# Altium project MCORD_Hub_v1.1.PrjPcb (part 2 of 4)

## Sheet Boost_CNV.SchDoc: MCORD_HUB
size 420 x 297 mm; Author: G.Kasprowicz; CompanyName: WUT ISE; DrawnBy: G.Kasprowicz; Organization: WUT ISE; Address1: PW ISE; Address2: Nowowiejska 15/19 00-665 Warsaw; Address3: gkasprow@gmail.com; DocumentNumber: 5; Revision: 2; SheetNumber: 5; SheetTotal: 6; ModifiedBy: -; CheckedDate: -; Title2: 70V boost converter; DivGrp: WUT ISE; Designer: G.Kasprowicz; ModifiedDate: -; ProjectName: Sensor Box
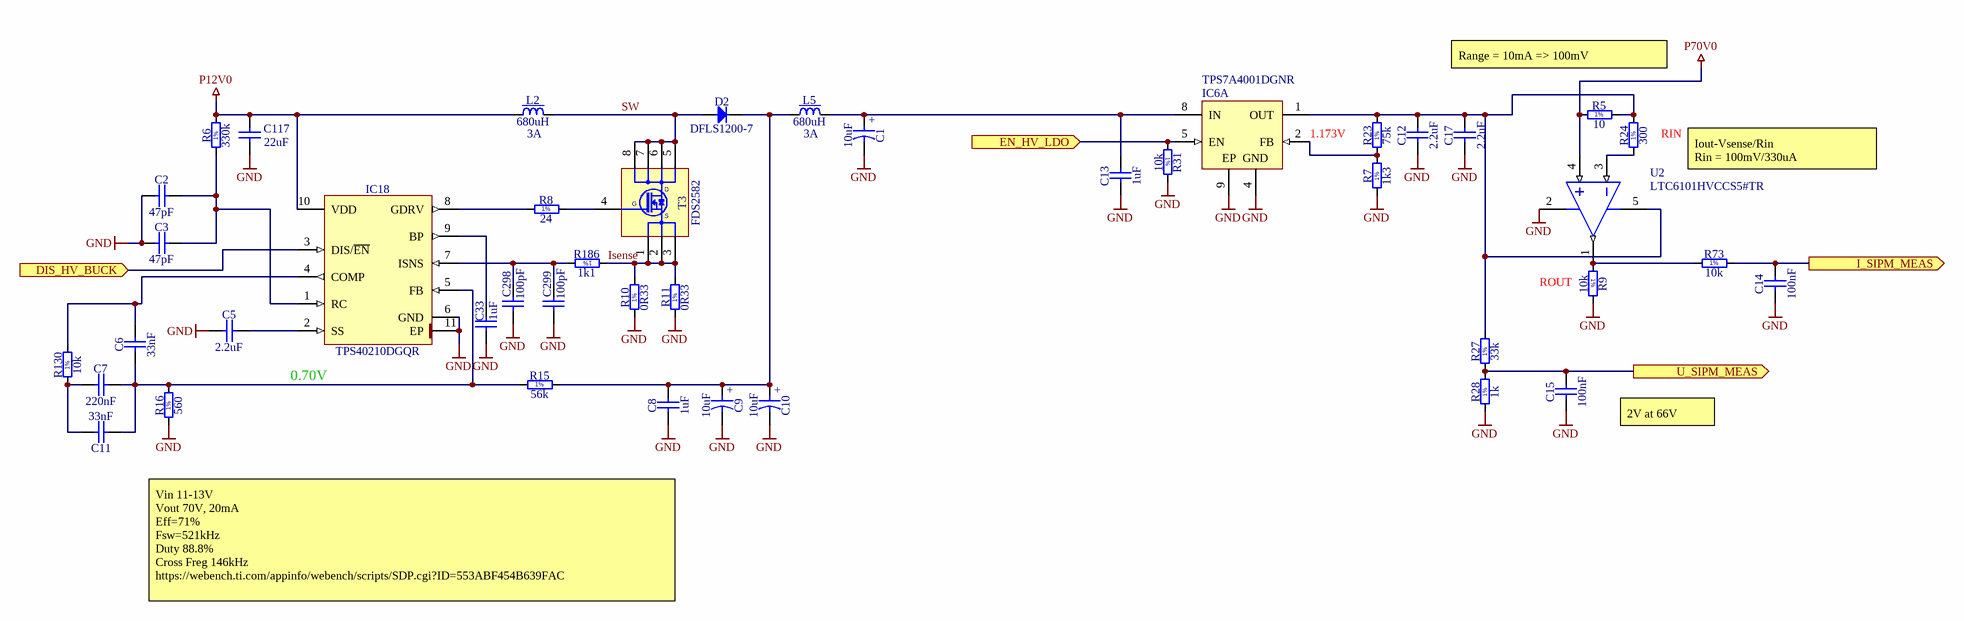
[diagram p2: Boost_CNV.SchDoc]

### Parts
C1  10uF  [CAPAE830X1020N]
C2  47pF  [CAPC1005X55N]
C3  47pF  [CAPC1005X55N]
C5  2.2uF  [CAPC2012X135N]
C6  33nF  [CAPC2012X135N]
C7  220nF  [CAPC2012X135N]
C8  1uF  [CAPC2013X145N]
C9  10uF  [CAPAE830X1020N]
C10  10uF  [CAPAE830X1020N]
C11  33nF  [CAPC2012X135N]
C12  2.2uF  [CAPC3225X230N]
C13  1uF  [CAPC2013X145N]
C14  100nF  [CAPC1005X55N]
C15  100nF  [CAPC1005X55N]
C17  2.2uF  [CAPC3225X230N]
C33  1uF  [CAPC1608X87N]
C117  22uF  [CAPC3216X180N]
C298  100pF  [CAPC1608X87N]
C299  100pF  [CAPC1608X87N]
D2  DFLS1200-7  [DIODES-INC_POWERDI123]
IC6  TPS7A4001DGNR  [DGN0008B_M]  (part A of 2)
IC18  TPS40210DGQR  [SOP50P490X110-11N-R157X188]
L2  680uH  Power: 3A  [IND_EPCOS_B82476A1]
L5  680uH  Power: 3A  [IND_EPCOS_B82476A1]
R5  10  [RESC3216X65N]
R6  330k  [RESC1608X55N]
R7  1k3  [RESC1608X55N]
R8  24  [RESC1608X55N]
R9  10k  [RESC1005X40N]
R10  0R33  [RESC3216X65N]
R11  0R33  [RESC3216X65N]
R15  56k  [RESC1608X55N]
R16  560  [RESC1608X55N]
R23  75k  [RESC1608X55N]
R24  300  [RESC1005X40N]
R27  33k  [RESC2012X60N]
R28  1k  [RESC1005X40N]
R31  10k  [RESC1005X40N]
R73  10k  [RESC1005X40N]
R130  10k  [RESC1005X40N]
R186  1k1  [RESC1608X55N]
T3  FDS2582  [SOIC127P600X175-8N]
U2  LTC6101HVCCS5#TR  [LT-S5-5-TSOT-23_M]

### Ports
DIS_HV_BUCK (in), EN_HV_LDO (in), I_SIPM_MEAS (out), U_SIPM_MEAS (out)

### Nets
GND: C1.2 C2.1 C3.1 C5.1 C8.1 C9.2 C10.2 C12.1 C13.1 C14.1 C15.1 C17.1 C33.1 C117.1 C298.1 C299.1 IC6.4(GND) IC6.9(EP) IC18.6(GND) IC18.11(EP) R7.1 R9.2 R10.1 R11.1 R16.1 R28.1 R31.2 U2.2(V-)
P12V0: C117.2 IC18.10(VDD) L2.1 R6.2
P70V0: R5.1 U2.4(+IN)
DIS_HV_BUCK: IC18.3(DIS/~{EN}) ; port DIS_HV_BUCK
EN_HV_LDO: IC6.5(EN) R31.1 ; port EN_HV_LDO
I_SIPM_MEAS: C14.2 R73.2 ; port I_SIPM_MEAS
Isense: R10.2 R11.2 R186.1 T3.1(S) T3.2(S) T3.3(S)
SW: D2.2(A) L2.2 T3.5(D) T3.6(D) T3.7(D) T3.8(D)
U_SIPM_MEAS: C15.2 R27.1 R28.2 ; port U_SIPM_MEAS
NetC1_1: C1.1 C13.2 IC6.8(IN) L5.2
NetC2_2: C2.2 C3.2 IC18.1(RC) R6.1
NetC5_2: C5.2 IC18.2(SS)
NetC6_1: C6.1 C7.2 C11.1 IC18.5(FB) R15.1 R16.2
NetC6_2: C6.2 IC18.4(COMP) R130.2
NetC7_1: C7.1 C11.2 R130.1
NetC8_2: C8.2 C9.1 C10.1 D2.1(C) L5.1 R15.2
NetC12_2: C12.2 C17.2 IC6.1(OUT) R5.2 R23.2 R24.2 R27.2 U2.5(V+)
NetC33_2: C33.2 IC18.9(BP)
NetC298_2: C298.2 C299.2 IC18.7(ISNS) R186.2
NetIC6_2: IC6.2(FB) R7.2 R23.1
NetIC18_8: IC18.8(GDRV) R8.1
NetR8_2: R8.2 T3.4(G)
NetR9_1: R9.1 R73.1 U2.1(OUT)
NetR24_1: R24.1 U2.3(-IN)

### Notes on the sheet
- Range = 10mA => 100mV
- 1.173V
- (near R24) RIN
- Iout-Vsense/Rin
  Rin = 100mV/330uA
- ROUT
- (near IC18) 0.70V
- 2V at 66V
- Vin 11-13V
  Vout 70V, 20mA
  Eff=71%
  Fsw=521kHz
  Duty 88.8%
  Cross Freg 146kHz
  https://webench.ti.com/appinfo/webench/scripts/SDP.cgi?ID=553ABF454B639FAC
- Project/Equipment
- Document
- Designer
- Drawn by
- Check.by
- Copyright WUT ISE 2018.
  This documentation describes Open Hardware and is licensed under the CERN OHL v.1.1. You may redistribute and modify this documentation under the terms of the CERN OHL v.1.1. (http://ohwr.org/CERNOHL). This documentation is distributed WITHOUT ANY EXPRESS OR IMPLIED WARRANTY, INCLUDING OF MERCHANTABILITY, SATISFACTORY QUALITY AND FITNESS FOR A PARTICULAR PURPOSE. Please see the CERN OHL v.1.1 for applicable conditions.
- Contact
- File
- Last Mod.
- Print Date
- Sheet
- Size
- A3
- of
- Rev
- (in symbol CAP_ELECTRO_SMD_F_10u_100V) +
- (in symbol R0402_1K_1%_0.0625W_100PPM) 1%
- (in symbol R0402_10K_1%_0.0625W_100PPM) 1%
- (in symbol R0402_300R_1%_0.0625W_100PPM) 1%
- (in symbol R0603_1K1_1%_0.1W_100PPM) 1%
- (in symbol R0603_1K3_1%_0.1W_100PPM) 1%
- (in symbol R0603_24R_1%_0.1W_100PPM) 1%
- (in symbol R0603_56K_1%_0.1W_100PPM) 1%
- (in symbol R0603_75K_1%_0.1W_100PPM) 1%
- (in symbol R0603_330K_1%_0.1W_100PPM) 1%
- (in symbol R0603_560R_1%_0.1W_100PPM) 1%
- (in symbol R0805_33K_1%_0.125W_100PPM) 1%
- (in symbol R1206_0R33_1%_0.5W_600PPM) 1%
- (in symbol R1206_10R_1%_0.25W_200PPM) 1%

### Library data of the parts
C1 C9 C10 = CAP_ELECTRO_SMD_F_10u_100V: 10uF, 100V, 1.5R; Part Number: CAE830-1020_10UF_100V_20%; Part Description: Aluminum Electrolytic SMT Capacitor; Manufacturer: PANASONIC; Manufacturer Part Number: EEEHD2A100P; Tolerance: ±20%; Table: Capacitors SMD; Component Kind: Standard; Component Type: Standard; Pin Count: 2; Value: 10uF; Status: Recommended; Voltage: 100V; Case: F; Mounted: Yes; Socket: No; SMD: Yes; ComponentHeight: 10.2mm; HelpURL: \\cern.ch\dfs\Applications\Altium\Datasheets\CAE_PANASONIC_FK.pdf; Author: CERN DEM JLC; CreateDate: 2007-12-03; LatestRevisionDate: 2014-11-05
C2 C3 = CC0402_47PF_50V_5%_C0G: Non-polarised capacitor; Part Description: SMD Multilayer Chip Ceramic Capacitor; Manufacturer: GENERIC; Manufacturer1 Part Number: C0402C470J5GACTU; Voltage: 50V; TC: C0G/NP0; Tolerance: ±5%; Part Number: CC0402_47PF_50V_5%_C0G; Component Kind: Standard; Component Type: Standard; Pin Count: 2; Value: 47pF; Status: Preferred; Manufacturer Part Number: CC0402_47PF_50V_5%_C0G; Case: 0402; Mounted: Yes; Socket: No; SMD: Yes; Sense: No; Manufacturer1 Example: KEMET; Manufacturer1 ComponentHeight: 0.55mm; HelpURL: \\cern.ch\dfs\Applications\Altium\Datasheets\CC0805_C0G_KEMET_(Commercial Grade).pdf; Author: CERN DEM JLC; CreateDate: 03.12.2007; LatestRevisionDate: 22.04.2015
C5 = CC0805_2.2UF_16V_10%_X7R: Non-polarised capacitor; Part Description: SMD Multilayer Chip Ceramic Capacitor; Manufacturer: GENERIC; Manufacturer1 Part Number: GRM21BF51C225ZA01L; Voltage: 16V; TC: X7R; Tolerance: ±10%; Part Number: CC0805_2.2UF_16V_10%_X7R; Component Kind: Standard; Component Type: Standard; Pin Count: 2; Value: 2.2uF; Status: Preferred; Manufacturer Part Number: CC0805_2.2UF_16V_10%_X7R; Case: 0805; Mounted: Yes; Socket: No; SMD: Yes; Sense: No; Manufacturer1 Example: MURATA; Manufacturer1 ComponentHeight: 1.5mm; HelpURL: \\cern.ch\dfs\Applications\Altium\Datasheets\CC0805_X7R_MURATA_GRM.pdf; Author: CERN DEM JLC; CreateDate: 03.12.2007; LatestRevisionDate: 18.09.2014
C6 C11 = CC0805_33NF_25V_10%_X7R: Non-polarised capacitor; Part Description: SMD Multilayer Chip Ceramic Capacitor; Manufacturer: GENERIC; Manufacturer1 Part Number: 223891015643; Voltage: 25V; TC: X7R; Tolerance: ±10%; Part Number: CC0805_33NF_25V_10%_X7R; Component Kind: Standard; Component Type: Standard; Pin Count: 2; Value: 33nF; Status: Preferred; Manufacturer Part Number: CC0805_33NF_25V_10%_X7R; Case: 0805; Mounted: Yes; Socket: No; SMD: Yes; Sense: No; Manufacturer1 Example: PHYCOMP; Manufacturer1 ComponentHeight: 1.35mm; HelpURL: \\cern.ch\dfs\Applications\Altium\Datasheets\CC0805_X7R_PHYCOMP.pdf; Author: CERN DEM JLC; CreateDate: 03.12.2007; LatestRevisionDate: 03.12.2007
C7 = CC0805_220NF_50V_10%_X7R: Non-polarised capacitor; Part Description: SMD Multilayer Chip Ceramic Capacitor; Manufacturer: GENERIC; Manufacturer1 Part Number: GRM21BR71H224KA01L; Voltage: 50V; TC: X7R; Tolerance: ±10%; Part Number: CC0805_220NF_50V_10%_X7R; Component Kind: Standard; Component Type: Standard; Pin Count: 2; Value: 220nF; Status: Preferred; Manufacturer Part Number: CC0805_220NF_50V_10%_X7R; Case: 0805; Mounted: Yes; Socket: No; SMD: Yes; Sense: No; Manufacturer1 Example: MURATA; Manufacturer1 ComponentHeight: 1.35mm; HelpURL: \\cern.ch\dfs\Applications\Altium\Datasheets\CC0805_X7R_MURATA.pdf; Author: CERN DEM JLC; CreateDate: 03.12.2007; LatestRevisionDate: 03.12.2007
C8 C13 = CC0805_1UF_100V_10%_X7S: Non-polarised capacitor; Part Description: SMD Multilayer Chip Ceramic Capacitor; Manufacturer: TDK; Manufacturer Part Number: C2012X7S2A105K125AB; Voltage: 100V; TC: X7S; Tolerance: ±10%; Part Number: CC0805_1UF_100V_10%_X7S; Component Kind: Standard; Component Type: Standard; Pin Count: 2; Value: 1uF; Status: None; Case: 0805; Mounted: Yes; Socket: No; SMD: Yes; Sense: No; ComponentHeight: 1.45mm; HelpURL: \\cern.ch\dfs\Applications\Altium\Datasheets\CC0805_X7S_TDK_C.pdf; Author: CERN DEM JLC; CreateDate: 12.12.2013; LatestRevisionDate: 20.01.2015
C12 C17 = CC1210_2.2UF_100V_10%_X7R_MURATA_GCJ32DR72A225KA01L: Non-polarised capacitor; Part Description: Soft Termination SMD Chip Monolithic Ceramic Capacitor for Automotive; Manufacturer: MURATA; Voltage: 100V; TC: X7R; Tolerance: ±10%; Part Number: CC1210_2.2UF_100V_10%_X7R_MURATA_GCJ32DR72A225KA01L; Component Kind: Standard; Component Type: Standard; Pin Count: 2; Value: 2.2uF; Status: Not Recommended; Manufacturer Part Number: GCJ32DR72A225KA01L; Case: 1210; Mounted: Yes; Socket: No; SMD: Yes; Sense: No; HelpURL: \\cern.ch\dfs\Applications\Altium\Datasheets\CC1210_MURATA_GCJ32DR72A225KA01L.pdf; Author: CERN DEM JLC; CreateDate: 10.05.2017; LatestRevisionDate: 10.05.2017; ComponentHeight: 2.3mm
C14 C15 = CC0402_100NF_16V_10%_X7R: Non-polarised capacitor; Part Description: SMD Multilayer Chip Ceramic Capacitor; Manufacturer: GENERIC; Manufacturer1 Part Number: GRM155R71C104KA88D; Voltage: 16V; TC: X7R; Tolerance: ±10%; Part Number: CC0402_100NF_16V_10%_X7R; Component Kind: Standard; Component Type: Standard; Pin Count: 2; Value: 100nF; Status: Not Recommended; Manufacturer Part Number: CC0402_100NF_16V_10%_X7R; Case: 0402; Mounted: Yes; Socket: No; SMD: Yes; Sense: No; HelpURL: \\cern.ch\dfs\Applications\Altium\Datasheets\CC0402_X7R_MURATA_GRM.pdf; Author: CERN DEM JLC; CreateDate: 05.12.2013; LatestRevisionDate: 03.12.2007; Manufacturer1 Example: MURATA; Manufacturer1 ComponentHeight: 0.55mm
C33 = CC0603_1UF_16V_10%_X7R: Non-polarised capacitor; Part Description: SMD Multilayer Chip Ceramic Capacitor; Manufacturer: GENERIC; Manufacturer1 Part Number: 223824613663; Voltage: 16V; TC: X7R; Tolerance: ±10%; Table: Capacitors SMD; Part Number: CC0603_1UF_16V_10%_X7R; Component Kind: Standard; Component Type: Standard; Pin Count: 2; Value: 1uF; Status: Preferred; Manufacturer Part Number: CC0603_1uF_16V_10%_X7R; Case: 0603; Mounted: Yes; Socket: No; SMD: Yes; Manufacturer1 Example: PHYCOMP; Manufacturer1 ComponentHeight: 0.87mm; HelpURL: \\cern.ch\dfs\Applications\Altium\Datasheets\CC0805_X5R_PHYCOMP_HC.pdf; Author: CERN DEM JLC; CreateDate: 03/12/2007; LatestRevisionDate: 03/12/2007
C117 = CC1206_22UF_10V_10%_X7R: Non-polarised capacitor; Part Description: SMD Multilayer Chip Ceramic Capacitor; Manufacturer: GENERIC; Manufacturer1 Part Number: GRM31CR71A226KE15L; Voltage: 10V; TC: X7R; Tolerance: ±10%; Table: Capacitors SMD; Part Number: CC1206_22UF_10V_10%_X7R; Component Kind: Standard; Component Type: Standard; Pin Count: 2; Value: 22uF; Status: Preferred; Manufacturer Part Number: CC1206_22UF_10V_10%_X7R; Case: 1206; Mounted: Yes; Socket: No; SMD: Yes; Manufacturer1 Example: MURATA; Manufacturer1 ComponentHeight: 1.8mm; HelpURL: \\cern.ch\dfs\Applications\Altium\Datasheets\CC1206_X7R_MURATA_GRM-HI-CAP.pdf; Author: CERN DEM JLC; CreateDate: 2010-06-08; LatestRevisionDate: 2010-06-08
C298 C299 = CC0603_100PF_50V_5%_NP0: Non-polarised capacitor; Part Description: SMD Multilayer Chip Ceramic Capacitor; Manufacturer: GENERIC; Manufacturer1 Part Number: 223886715101; Voltage: 50V; TC: NP0; Tolerance: ±5%; Table: Capacitors SMD; Part Number: CC0603_100PF_50V_5%_NP0; Component Kind: Standard; Component Type: Standard; Pin Count: 2; Value: 100pF; Status: Preferred; Manufacturer Part Number: CC0603_100PF_50V_5%_NP0; Case: 0603; Mounted: Yes; Socket: No; SMD: Yes; Manufacturer1 Example: PHYCOMP; Manufacturer1 ComponentHeight: 0.87mm; HelpURL: \\cern.ch\dfs\Applications\Altium\Datasheets\CC0603_NP0_PHYCOMP.pdf; Author: CERN DEM JLC; CreateDate: 2007-12-03; LatestRevisionDate: 2007-12-03
D2 = DFLS1200-7: Diode; Part Description: High Voltage Schttky Barrier Rectifier; Manufacturer: DIODES INCORPORATED; Voltage: 200V; Power: 1A; PressFit: No; Bonding: No; Part Number: DFLS1200-7; Component Kind: Standard; Component Type: Standard; Device: DFLS1200-7; PackageDescription: SODFL Diode; 2.8mm W X 1.78mm L X mm H Body, POWERDI®123 Case; Manufacturer Part Number: DFLS1200-7; Pin Count: 2; Mounted: Yes; Socket: No; SMD: Yes; Sense: No; ComponentHeight: 1mm; HelpURL: \\cern.ch\dfs\Applications\Altium\Datasheets\DFLS1200-7.pdf; Author: CERN DEM JLC; CreateDate: 15.09.2014; LatestRevisionDate: 15.09.2014
IC6 = CMP-0394-01258-2: Single Output LDO, 50 mA, Adjustable 1.175 to 90 V Output, 7 to 100 V Input, 8-pin MSOP (DGN), -40 to 125 degC, Green (RoHS & no Sb/Br); Manufacturer: Texas Instruments; Iout(Max)(A): 0.05; Vin(Max)(V): 100; Vout Adj(Min)(V): 1.2; Accuracy(%): 2.5; SubFamily: Single Channel LDO; Vin(Min)(V): 7; Iq(Typ)(mA): 0.02; Vdo(Typ)(mV): 290; Vout Adj(Max)(V): 90; ComponentLink1URL: http://www.ti.com/; PackageDescription: 8-Pin Plastic Small Outline, Body 3 x 3 mm, Pitch 0.65 mm; PartNumber: TPS7A4001DGNR; Mounting Technology: Surface Mount; PackageReference: DGN0008B; ComponentLink1Description: Manufacturer URL; Code_JEDEC: MO-187; DatasheetVersion: SBVS162A; ComponentLink2URL: http://www.ti.com/general/docs/lit/getliterature.tsp?genericPartNumber=TPS7A4001&fileType=pdf; ComponentLink2Description: Datasheet; Eco-Plan: Green (RoHS & no Sb/Br); PackageVersion: 4073271/F; ComponentLink3URL: http://www.ti.com/litv/pdf/mpds046e; ComponentLink3Description: Package Specification
IC18 = TPS40210DGQR: Wide-Input Voltage (4.5V to 52V) Input Current Mode Boost Controller; Manufacturer: TEXAS INSTRUMENTS; Table: Regulators; Part Number: TPS40210DGQR; Component Kind: Standard; Component Type: Standard; Device: TPS40210DGQR; PackageDescription: SOP, 0.50mm, pitch; 10 pin, 3.00mm W X 3.00mm L X 1.10mm H body (w/thermal tab  1.57 X 1.88 mm), IPC Medium Density; Part Description: Wide-Input Voltage (4.5V to 52V) Input Current Mode Boost Controller; Manufacturer Part Number: TPS40210DGQR; Pin Count: 11; Case: TSSOP10; Mounted: Yes; Socket: No; SMD: Yes; ComponentHeight: 1.1mm; HelpURL: \\cern.ch\dfs\Applications\Altium\Datasheets\TPS40210DGQR.pdf; Author: CERN DEM JLC; CreateDate: 16/04/2012; LatestRevisionDate: 16/04/2012
L2 L5 = IND_680UH_20%_EPCOS_B82476A1: 680uH, 3A, 0.17R; Part Number: IND_680UH_20%_COILCRAFT_DO3340P-684MLB; Part Description: SMT Power Inductor (12.95x9.4x5.08mm); Manufacturer: Coilcraft; Manufacturer Part Number: DO3340P-684MLB; Tolerance: ±20%; Component Kind: Standard; Component Type: Standard; Pin Count: 2; Value: 680uH; Status: None; Resistance: 0.17R; Mounted: Yes; Socket: No; SMD: Yes; Sense: No; ComponentHeight: 3mm; HelpURL: \\cern.ch\dfs\Applications\Altium\Datasheets\IND_EPCOS_B82476A1.pdf; Author: GK; CreateDate: 07.01.2014; LatestRevisionDate: 07.01.2014
R5 = R1206_10R_1%_0.25W_200PPM: Resistor - 1%; Part Description: General Purpose Thick Film Chip Resistor; Manufacturer: GENERIC; Manufacturer1 Part Number: NRC12F10R0TRF; Power: 0.25W; TC: ±200ppm/°C; PressFit: No; Part Number: R1206_10R_1%_0.25W_200PPM; Component Kind: Standard; Component Type: Standard; Pin Count: 2; Value: 10; Status: Preferred; Tolerance: ±1%; Manufacturer Part Number: R1206_10R_1%_0.25W_200PPM; Case: 1206; Mounted: Yes; Sense: No; Socket: No; SMD: Yes; Manufacturer1 Example: NIC COMPONENT; Manufacturer1 ComponentHeight: 0.65mm; HelpURL: \\cern.ch\dfs\Applications\Altium\Datasheets\R1206_NIC_NRC.pdf; Author: CERN DEM JLC; CreateDate: 24.06.2009; LatestRevisionDate: 24.06.2009
R6 = R0603_330K_1%_0.1W_100PPM: Resistor - 1%; Part Description: General Purpose Thick Film Chip Resistor; Manufacturer: GENERIC; Manufacturer1 Part Number: NRC06F3303TRF; Power: 0.1W; TC: ±100ppm/°C; PressFit: No; Part Number: R0603_330K_1%_0.1W_100PPM; Component Kind: Standard; Component Type: Standard; Pin Count: 2; Value: 330k; Status: Preferred; Tolerance: ±1%; Manufacturer Part Number: R0603_330K_1%_0.1W_100PPM; Case: 0603; Mounted: Yes; Sense: No; Socket: No; SMD: Yes; Manufacturer1 Example: NIC COMPONENT; Manufacturer1 ComponentHeight: 0.55mm; HelpURL: \\cern.ch\dfs\Applications\Altium\Datasheets\R0603_NIC_NRC.pdf; Author: CERN DEM JLC; CreateDate: 03.12.2007; LatestRevisionDate: 13.03.2008
R7 = R0603_1K3_1%_0.1W_100PPM: Resistor - 1%; Part Description: General Purpose Thick Film Chip Resistor; Manufacturer: GENERIC; Manufacturer1 Part Number: NRC06F1301TRF; Power: 0.1W; TC: ±100ppm/°C; PressFit: No; Part Number: R0603_1K3_1%_0.1W_100PPM; Component Kind: Standard; Component Type: Standard; Pin Count: 2; Value: 1k3; Status: Preferred; Tolerance: ±1%; Manufacturer Part Number: R0603_1K3_1%_0.1W_100PPM; Case: 0603; Mounted: Yes; Sense: No; Socket: No; SMD: Yes; Manufacturer1 Example: NIC COMPONENT; Manufacturer1 ComponentHeight: 0.55mm; HelpURL: \\cern.ch\dfs\Applications\Altium\Datasheets\R0603_NIC_NRC.pdf; Author: CERN DEM JLC; CreateDate: 03.12.2007; LatestRevisionDate: 13.03.2008
R8 = R0603_24R_1%_0.1W_100PPM: Resistor - 1%; Part Description: General Purpose Thick Film Chip Resistor; Manufacturer: GENERIC; Manufacturer1 Part Number: NRC06F24R0TRF; Power: 0.1W; TC: ±100ppm/°C; PressFit: No; Part Number: R0603_24R_1%_0.1W_100PPM; Component Kind: Standard; Component Type: Standard; Pin Count: 2; Value: 24; Status: Preferred; Tolerance: ±1%; Manufacturer Part Number: R0603_24R_1%_0.1W_100PPM; Case: 0603; Mounted: Yes; Sense: No; Socket: No; SMD: Yes; Manufacturer1 Example: NIC COMPONENT; Manufacturer1 ComponentHeight: 0.55mm; HelpURL: \\cern.ch\dfs\Applications\Altium\Datasheets\R0603_NIC_NRC.pdf; Author: CERN DEM JLC; CreateDate: 03.12.2007; LatestRevisionDate: 13.03.2008
R9 R31 R73 R130 = R0402_10K_1%_0.0625W_100PPM: Resistor - 1%; Part Description: General Purpose Thick Film Chip Resistor; Manufacturer: GENERIC; Manufacturer1 Part Number: 232270671003L; TC: ±100ppm/°C; PressFit: No; Part Number: R0402_10K_1%_0.0625W_100PPM; Component Kind: Standard; Component Type: Standard; Pin Count: 2; Value: 10k; Status: Not Recommended; Power: 0.0625W; Tolerance: ±1%; Manufacturer Part Number: R0402_10K_1%_0.0625W_100PPM; Case: 0402; Mounted: Yes; Sense: No; Socket: No; SMD: Yes; Manufacturer1 Example: YAGEO PHYCOMP; Manufacturer1 ComponentHeight: 0.4mm; HelpURL: \\cern.ch\dfs\Applications\Altium\Datasheets\R0402_Phycomp_RC0402.pdf; Author: CERN DEM JLC; CreateDate: 03.12.2007; LatestRevisionDate: 17.10.2012
R10 R11 = R1206_0R33_1%_0.5W_600PPM: Resistor - 1%; Part Description: Low Ohmique High Power Chip Resistor; Manufacturer: YAGEO PHYCOMP; Manufacturer Part Number: RL1206FR-7W0R33 (235051913307); Power: 0.5W; TC: ±600ppm/°C; PressFit: No; Part Number: R1206_0R33_1%_0.5W_600PPM; Component Kind: Standard; Component Type: Standard; Pin Count: 2; Value: 0R33; Status: Not Recommended; Tolerance: ±1%; Case: 1206; Mounted: Yes; Sense: No; Socket: No; SMD: Yes; ComponentHeight: 0.65mm; HelpURL: \\cern.ch\dfs\Applications\Altium\Datasheets\R1206_PHYCOMP_LRC02P.pdf; Author: CERN DEM JMW; CreateDate: 06.01.2009; LatestRevisionDate: 06.01.2009
R15 = R0603_56K_1%_0.1W_100PPM: Resistor - 1%; Part Description: General Purpose Thick Film Chip Resistor; Manufacturer: GENERIC; Manufacturer1 Part Number: NRC06F5602TRF; Power: 0.1W; TC: ±100ppm/°C; PressFit: No; Part Number: R0603_56K_1%_0.1W_100PPM; Component Kind: Standard; Component Type: Standard; Pin Count: 2; Value: 56k; Status: Preferred; Tolerance: ±1%; Manufacturer Part Number: R0603_56K_1%_0.1W_100PPM; Case: 0603; Mounted: Yes; Sense: No; Socket: No; SMD: Yes; Manufacturer1 Example: NIC COMPONENT; Manufacturer1 ComponentHeight: 0.55mm; HelpURL: \\cern.ch\dfs\Applications\Altium\Datasheets\R0603_NIC_NRC.pdf; Author: CERN DEM JLC; CreateDate: 03.12.2007; LatestRevisionDate: 13.03.2008
R16 = R0603_560R_1%_0.1W_100PPM: Resistor - 1%; Part Description: General Purpose Thick Film Chip Resistor; Manufacturer: GENERIC; Manufacturer1 Part Number: NRC06F5600TRF; Power: 0.1W; TC: ±100ppm/°C; PressFit: No; Part Number: R0603_560R_1%_0.1W_100PPM; Component Kind: Standard; Component Type: Standard; Pin Count: 2; Value: 560; Status: Preferred; Tolerance: ±1%; Manufacturer Part Number: R0603_560R_1%_0.1W_100PPM; Case: 0603; Mounted: Yes; Sense: No; Socket: No; SMD: Yes; Manufacturer1 Example: NIC COMPONENT; Manufacturer1 ComponentHeight: 0.55mm; HelpURL: \\cern.ch\dfs\Applications\Altium\Datasheets\R0603_NIC_NRC.pdf; Author: CERN DEM JLC; CreateDate: 03.12.2007; LatestRevisionDate: 13.03.2008
R23 = R0603_75K_1%_0.1W_100PPM: Resistor - 1%; Part Description: General Purpose Thick Film Chip Resistor; Manufacturer: GENERIC; Manufacturer1 Part Number: NRC06F7502TRF; Power: 0.1W; TC: ±100ppm/°C; PressFit: No; Part Number: R0603_75K_1%_0.1W_100PPM; Component Kind: Standard; Component Type: Standard; Pin Count: 2; Value: 75k; Status: Preferred; Tolerance: ±1%; Manufacturer Part Number: R0603_75K_1%_0.1W_100PPM; Case: 0603; Mounted: Yes; Sense: No; Socket: No; SMD: Yes; Manufacturer1 Example: NIC COMPONENT; Manufacturer1 ComponentHeight: 0.55mm; HelpURL: \\cern.ch\dfs\Applications\Altium\Datasheets\R0603_NIC_NRC.pdf; Author: CERN DEM JLC; CreateDate: 03.12.2007; LatestRevisionDate: 13.03.2008
R24 = R0402_300R_1%_0.0625W_100PPM: Resistor - 1%; Part Description: General Purpose Thick Film Chip Resistor; Manufacturer: GENERIC; Manufacturer1 Part Number: 232270673001L; TC: ±100ppm/°C; PressFit: No; Part Number: R0402_300R_1%_0.0625W_100PPM; Component Kind: Standard; Component Type: Standard; Pin Count: 2; Value: 300; Status: Not Recommended; Power: 0.0625W; Tolerance: ±1%; Manufacturer Part Number: R0402_300R_1%_0.0625W_100PPM; Case: 0402; Mounted: Yes; Sense: No; Socket: No; SMD: Yes; Manufacturer1 Example: YAGEO PHYCOMP; Manufacturer1 ComponentHeight: 0.4mm; HelpURL: \\cern.ch\dfs\Applications\Altium\Datasheets\R0402_Phycomp_RC0402.pdf; Author: CERN DEM JLC; CreateDate: 03.12.2007; LatestRevisionDate: 17.10.2012
R27 = R0805_33K_1%_0.125W_100PPM: Resistor - 1%; Part Description: General Purpose Thick Film Chip Resistor; Manufacturer: GENERIC; Manufacturer1 Part Number: NRC10F3302TRF; Power: 0.125W; TC: ±100ppm/°C; PressFit: No; Part Number: R0805_33K_1%_0.125W_100PPM; Component Kind: Standard; Component Type: Standard; Pin Count: 2; Value: 33k; Status: Preferred; Tolerance: ±1%; Manufacturer Part Number: R0805_33K_1%_0.125W_100PPM; Case: 0805; Mounted: Yes; Sense: No; Socket: No; SMD: Yes; Manufacturer1 Example: NIC COMPONENT; Manufacturer1 ComponentHeight: 0.6mm; HelpURL: \\cern.ch\dfs\Applications\Altium\Datasheets\R0805_NIC_NRC.pdf; Author: CERN DEM JLC; CreateDate: 03.12.2007; LatestRevisionDate: 13.03.2008
R28 = R0402_1K_1%_0.0625W_100PPM: Resistor - 1%; Part Description: General Purpose Thick Film Chip Resistor; Manufacturer: GENERIC; Manufacturer1 Part Number: 232270671002L; TC: ±100ppm/°C; PressFit: No; Part Number: R0402_1K_1%_0.0625W_100PPM; Component Kind: Standard; Component Type: Standard; Pin Count: 2; Value: 1k; Status: Not Recommended; Power: 0.0625W; Tolerance: ±1%; Manufacturer Part Number: R0402_1K_1%_0.0625W_100PPM; Case: 0402; Mounted: Yes; Sense: No; Socket: No; SMD: Yes; Manufacturer1 Example: YAGEO PHYCOMP; Manufacturer1 ComponentHeight: 0.4mm; HelpURL: \\cern.ch\dfs\Applications\Altium\Datasheets\R0402_Phycomp_RC0402.pdf; Author: CERN DEM JLC; CreateDate: 03.12.2007; LatestRevisionDate: 17.10.2012
R186 = R0603_1K1_1%_0.1W_100PPM: Resistor - 1%; Part Description: General Purpose Thick Film Chip Resistor; Manufacturer: GENERIC; Manufacturer1 Part Number: NRC06F1101TRF; Power: 0.1W; TC: ±100ppm/°C; Table: Resistors SMD; Part Number: R0603_1K1_1%_0.1W_100PPM; Component Kind: Standard; Component Type: Standard; Pin Count: 2; Value: 1k1; Status: Preferred; Tolerance: ±1%; Manufacturer Part Number: R0603_1K1_1%_0.1W_100PPM; Case: 0603; Mounted: Yes; Socket: No; SMD: Yes; Manufacturer1 Example: NIC COMPONENT; Manufacturer1 ComponentHeight: 0.55mm; HelpURL: \\cern.ch\dfs\Applications\Altium\Datasheets\R0603_NIC_NRC.pdf; Author: CERN DEM JLC; CreateDate: 2007-12-03; LatestRevisionDate: 2008-03-13
T3 = FDS2582: 150V 4.1A N-Channel PowerTrench® MOSFET; Manufacturer: FAIRCHILD SEMICONDUCTOR; PressFit: No; Bonding: No; Part Number: FDS2582; Component Kind: Standard; Component Type: Standard; Device: FDS2582; PackageDescription: SOIC 8, Pitch 1.27mm - Body 4x5mm, IPC Medium Density; Part Description: 150V 4.1A N-Channel PowerTrench® MOSFET; Manufacturer Part Number: FDS2582; Pin Count: 8; Case: SOIC8; Mounted: Yes; Socket: No; SMD: Yes; Sense: No; ComponentHeight: 1.75mm; HelpURL: \\cern.ch\dfs\Applications\Altium\Datasheets\FDS2582.pdf; Author: CERN DEM JLC; CreateDate: 08.04.2009; LatestRevisionDate: 08.04.2009
U2 = CMP-0359-01901-2: Single Channel, High Voltage, High-Side Current Sense Operational Amplifier, 0.2 MHz Typical GBW, 4 to 60 V, 5-Pin SOT23 (S5-5), Commercial, Reel; Manufacturer: Linear Technology; Channels (#): 1; GBW (MHz) Typical: 0.2; Is (mA) Typical: 0.22; Vs Min (V): 4; Vs Max (V): 60; Vos (mV) Typical: 0.15; Code_JEDEC: MO-193; ComponentLink3URL: http://cds.linear.com/docs/en/packaging/SOT_5_05-08-1635.pdf; ComponentLink2URL: http://cds.linear.com/docs/en/datasheet/6101fh.pdf; PackageDescription: 5-Lead Plastic TSOT-23, Body 1.63 x 2.90 mm, Pitch 0.95 mm; ComponentLink3Description: Package Specification; PartNumber: LTC6101HVCCS5#TR; ComponentLink1Description: Manufacturer URL; Packing: Reel; Linear Technology Part Number: LTC6101HV; DatasheetVersion: Rev. H; ComponentLink1URL: http://www.linear.com/; ComponentLink2Description: Datasheet; Type: CSA; PackageReference: LT-S5-5-TSOT-23; Mounting Technology: Surface Mount; RevisionNote: URLs updated

## Sheet RMII_Ethernet.SchDoc
size A3
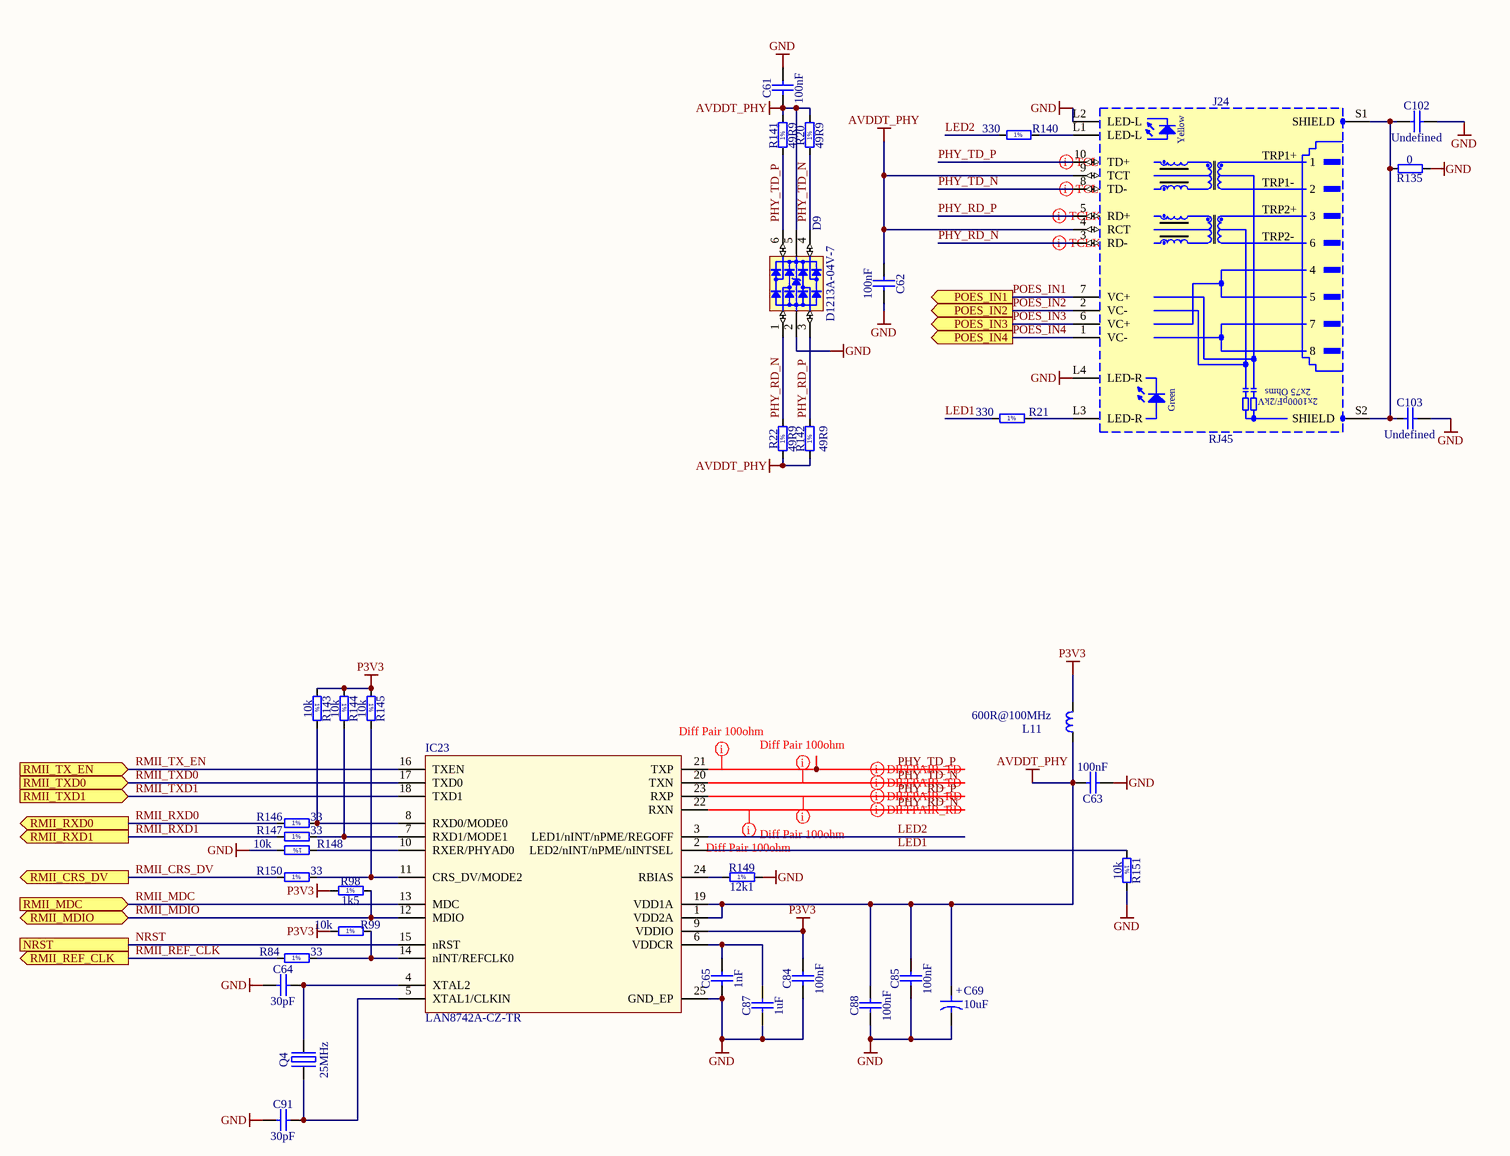
[diagram p3: RMII_Ethernet.SchDoc]

### Parts
C61  100nF  [CAPC1005X55N]
C62  100nF  [CAPC1005X55N]
C63  100nF  [CAPC1005X55N]
C64  30pF  [CAPC1005X55N]
C65  1nF  [CAPC1608X87N]
C69  10uF  [CAPMP3216X180N]
C84  100nF  [CAPC1005X55N]
C85  100nF  [CAPC1005X55N]
C87  1uF  [CAPC1608X87N]
C88  100nF  [CAPC1005X55N]
C91  30pF  [CAPC1005X55N]
C102  Undefined  [CAPC2012X135N]
C103  Undefined  [CAPC2012X135N]
D9  D1213A-04V-7  [SOTFL50P160X60-6N]
IC23  LAN8742A-CZ-TR  [QFN24_0R5_4X4]
J24  RJ45  [ABRACON_ARJM11C7-114-BA-EW2]
L11  600R@100MHz  [INDC1005X55N]
Q4  25MHz  [XTAL_ABRACON_ABLS]
R20  49R9  [RESC1005X40N]
R21  330  [RESC1005X40N]
R22  49R9  [RESC1005X40N]
R84  33  [RESC1005X40N]
R98  1k5  [RESC1005X40N]
R99  10k  [RESC1005X40N]
R135  0  [RESC1608X55N]
R140  330  [RESC1005X40N]
R141  49R9  [RESC1005X40N]
R142  49R9  [RESC1005X40N]
R143  10k  [RESC1005X40N]
R144  10k  [RESC1005X40N]
R145  10k  [RESC1005X40N]
R146  33  [RESC1005X40N]
R147  33  [RESC1005X40N]
R148  10k  [RESC1005X40N]
R149  12k1  [RESC1005X40N]
R150  33  [RESC1005X40N]
R151  10k  [RESC1005X40N]

### Ports
NRST, POES_IN1 (out), POES_IN2 (out), POES_IN3 (out), POES_IN4 (out), RMII_CRS_DV (out), RMII_MDC (in), RMII_MDIO (bidir), RMII_REF_CLK (out), RMII_RXD0 (out), RMII_RXD1 (out), RMII_TX_EN (in), RMII_TXD0 (in), RMII_TXD1 (in)

### Nets
AVDDT_PHY: C61.1 C62.2 C63.2 C69.1 C85.2 C88.2 D9.5(VBUS) IC23.1(VDD2A) IC23.19(VDD1A) J24.4(RCT) J24.9(TCT) L11.1 R20.2 R22.1 R141.2 R142.1
GND: C61.2 C62.1 C63.1 C64.1 C65.1 C69.2 C84.1 C85.1 C87.1 C88.1 C91.1 C102.2 C103.2 D9.2(GND) IC23.25(GND_EP) J24.L2(LED-L) J24.L4(LED-R) R135.1 R148.2 R149.2 R151.2
P3V3: C84.2 IC23.9(VDDIO) L11.2 R98.1 R99.1 R143.1 R144.1 R145.1
LED1: IC23.2(LED2/nINT/nPME/nINTSEL) R21.1 R151.1
LED2: IC23.3(LED1/nINT/nPME/REGOFF) R140.1
NRST: IC23.15(nRST) ; port NRST
PHY_RD_N: D9.1(I/O1) IC23.22(RXN) J24.3(RD-) R22.2
PHY_RD_P: D9.3(I/O2) IC23.23(RXP) J24.5(RD+) R142.2
PHY_TD_N: D9.4(I/O3) IC23.20(TXN) J24.8(TD-) R20.1
PHY_TD_P: D9.6(I/O4) IC23.21(TXP) J24.10(TD+) R141.1
POES_IN1: J24.7(VC+) ; port POES_IN1
POES_IN2: J24.2(VC-) ; port POES_IN2
POES_IN3: J24.6(VC+) ; port POES_IN3
POES_IN4: J24.1(VC-) ; port POES_IN4
RMII_CRS_DV: R150.1 ; port RMII_CRS_DV
RMII_MDC: IC23.13(MDC) ; port RMII_MDC
RMII_MDIO: IC23.12(MDIO) R98.2 ; port RMII_MDIO
RMII_REF_CLK: R84.1 ; port RMII_REF_CLK
RMII_RXD0: R146.1 ; port RMII_RXD0
RMII_RXD1: R147.1 ; port RMII_RXD1
RMII_TX_EN: IC23.16(TXEN) ; port RMII_TX_EN
RMII_TXD0: IC23.17(TXD0) ; port RMII_TXD0
RMII_TXD1: IC23.18(TXD1) ; port RMII_TXD1
NetC64_2: C64.2 IC23.4(XTAL2) Q4.2(OSC2)
NetC65_2: C65.2 C87.2 IC23.6(VDDCR)
NetC91_2: C91.2 IC23.5(XTAL1/CLKIN) Q4.1(OSC1)
NetC102_1: C102.1 C103.1 J24.S1(SHIELD) J24.S2(SHIELD) R135.2
NetIC23_7: IC23.7(RXD1/MODE1) R144.2 R147.2
NetIC23_8: IC23.8(RXD0/MODE0) R143.2 R146.2
NetIC23_10: IC23.10(RXER/PHYAD0) R148.1
NetIC23_11: IC23.11(CRS_DV/MODE2) R145.2 R150.2
NetIC23_14: IC23.14(nINT/REFCLK0) R84.2 R99.2
NetIC23_24: IC23.24(RBIAS) R149.1
NetJ24_L1: J24.L1(LED-L) R140.2
NetJ24_L3: J24.L3(LED-R) R21.2

### Layout directives
differential pair: PHY_RD_N, PHY_RD_P, PHY_TD_N, PHY_TD_P
rule Matched Net Lengths [Tolerance = 100mil]: PHY_RD_N, PHY_RD_P, PHY_TD_N, PHY_TD_P

### Notes on the sheet
- (in symbol CON_ETH_POE_ARJM11C7) Yellow; TRP1+; TRP1-; TRP2+; TRP2-; 2x75 Ohms; Green; 2x1000pF/2kV
- (in symbol CTE3216-18_10UF_16V_20%_AVX_TCJ) +
- (in symbol R0402_1K5_1%_0.0625W_100PPM) 1%
- (in symbol R0402_10K_1%_0.0625W_100PPM) 1%
- (in symbol R0402_12K1_1%_0.0625W_100PPM) 1%
- (in symbol R0402_33R_1%_0.0625W_100PPM) 1%
- (in symbol R0402_49R9_1%_0.0625W_100PPM) 1%
- (in symbol R0402_330R_1%_0.0625W_100PPM) 1%

### Library data of the parts
C61-C63 C84 C85 C88 = CC0402_100NF_16V_10%_X7R: as C14 on sheet Boost_CNV; Part Number: CC0402_100NF_16V_10%_X7R; Component Kind: Standard; Component Type: Standard; Pin Count: 2; Value: 100nF; Status: Not Recommended; Manufacturer Part Number: CC0402_100NF_16V_10%_X7R; Case: 0402; Mounted: Yes; Socket: No; SMD: Yes; Manufacturer1 Example: MURATA; Manufacturer1 ComponentHeight: 0.55mm; HelpURL: \\cern.ch\dfs\Applications\Altium\Datasheets\CC0402_X7R_MURATA_GRM.pdf; Author: CERN DEM JLC; CreateDate: 05.12.2013; LatestRevisionDate: 03.12.2007; Sense: No
C64 C91 = CC0402_30PF_50V_1%_C0G_MURATA_GJM1555C1H300FB01: Non-polarised capacitor; Part Description: High-Q SMD Chip Monolithic Ceramic Capacitor; Manufacturer: MURATA; Manufacturer Part Number: GJM1555C1H300FB01D; Voltage: 50V; TC: C0G/NP0; Tolerance: ±1%; Part Number: CC0402_30PF_50V_1%_C0G_MURATA_GJM1555C1H300FB01; Component Kind: Standard; Component Type: Standard; Pin Count: 2; Value: 30pF; Status: Not Recommended; Case: 0402; Mounted: Yes; Socket: No; SMD: Yes; Sense: No; ComponentHeight: 0.55mm; HelpURL: \\cern.ch\dfs\Applications\Altium\Datasheets\CC0402_MURATA_GJM1555C1H300FB01D.pdf; Author: CERN DEM BC; CreateDate: 20/11/2017; LatestRevisionDate: 20/11/2017
C65 = CC0603_1NF_100V_10%_X7R: Non-polarised capacitor; Part Description: SMD Multilayer Chip Ceramic Capacitor; Manufacturer: GENERIC; Manufacturer1 Part Number: C0603C102K1RACTU; Voltage: 100V; TC: X7R; Tolerance: ±10%; Part Number: CC0603_1NF_100V_10%_X7R; Component Kind: Standard; Component Type: Standard; Pin Count: 2; Value: 1nF; Status: Preferred; Manufacturer Part Number: CC0603_1NF_100V_10%_X7R; Case: 0603; Mounted: Yes; Socket: No; SMD: Yes; Sense: No; Manufacturer1 Example: KEMET; Manufacturer1 ComponentHeight: 0.87mm; HelpURL: \\cern.ch\dfs\Applications\Altium\Datasheets\CC0603_X7R_KEMET.pdf; Author: CERN DEM JLC; CreateDate: 12.12.2013; LatestRevisionDate: 12.12.2013
C69 = CTE3216-18_10UF_16V_20%_AVX_TCJ: Polarised capacitor; Part Description: ESR 0R200 Tantalum Solid Electrolytic Chip Capacitor with Conductive Polymer Electrode; Manufacturer: AVX; Manufacturer Part Number: TCJA106M016R0200; Voltage: 16V; Tolerance: ±20%; Part Number: CTE3216-18_10UF_16V_20%_AVX_TCJ; Component Kind: Standard; Component Type: Standard; Pin Count: 2; Value: 10uF; Status: Preferred; Case: A; Mounted: Yes; Socket: No; SMD: Yes; Sense: No; ComponentHeight: 1.8mm; HelpURL: \\cern.ch\dfs\Applications\Altium\Datasheets\CTE_AVX_TCJ.pdf; Author: CERN DEM JLC; CreateDate: 29.03.2012; LatestRevisionDate: 29.03.2012
C87 = CC0603_1UF_16V_10%_X7R: Non-polarised capacitor; Part Description: SMD Multilayer Chip Ceramic Capacitor; Manufacturer: GENERIC; Manufacturer1 Part Number: 223878615663; Voltage: 16V; TC: X7R; Tolerance: ±10%; Part Number: CC0603_1UF_16V_10%_X7R; Component Kind: Standard; Component Type: Standard; Pin Count: 2; Value: 1uF; Status: None; Manufacturer Part Number: CC0603_1uF_16V_10%_X7R; Case: 0603; Mounted: Yes; Socket: No; SMD: Yes; Sense: No; Manufacturer1 Example: YAGEO PHYCOMP; Manufacturer1 ComponentHeight: 0.9mm; HelpURL: \\cern.ch\dfs\Applications\Altium\Datasheets\CC0603_X7R_PHYCOMP.pdf; Author: CERN DEM JLC; CreateDate: 03/12/2007; LatestRevisionDate: 17/04/2015
C102 C103 = CC0805_NO-VALUE: Non-polarised capacitor; Part Description: Reserved Footprint For 0805(2012) Chip Ceramic Capacitor; Mounted: No; Part Number: CC0805_NO-VALUE; Component Kind: Standard; Component Type: Standard; Pin Count: 2; Value: Undefined; Status: None; Manufacturer: Undefined; Manufacturer Part Number: CC0805_NO-VALUE; Case: 0805; Socket: No; SMD: Yes; Sense: No; Manufacturer1 ComponentHeight: 1.35mm; HelpURL: Undefined; Author: CERN DEM JLC; CreateDate: 10.12.2008; LatestRevisionDate: 11.09.2013
D9 = NUP4114UPXV6T1G: Part Description: ESD Protection Diodes Array (8kV) with Low Clamping Voltage; Manufacturer: DIODES; Voltage: 6V; PressFit: No; Bonding: No; Part Number: D1213A-04V-7; Component Kind: Standard; Component Type: Standard; Device: D1213A-04V-7; PackageDescription: SOTFL (SOT666, SOT563,), 0.50mm, Pitch; 6 Pin, 1.20mm W X 1.60mm L X 0.60mm H Body, IPC Medium Density; Manufacturer Part Number: D1213A-04V-7; Pin Count: 8; Mounted: Yes; Socket: No; SMD: Yes; Sense: No; ComponentHeight: 1.75mm; HelpURL: \\cern.ch\dfs\Applications\Altium\Datasheets\NUP4114UPXV6T1G.pdf; Author: GK; CreateDate: 05.12.2012; LatestRevisionDate: 05.12.2012
IC23 = IFC_LAN8742A: LAN8742A-CZ-TR - Small Footprint RMII 10/100 Ethernet, Transceiver with HP Auto-MDIX and flexPWR Technology SQFN-24; Manuf_1: MICROCHIP; Order: LAN8742A-CZ-TR; Manuf_Part_1: LAN8742A-CZ-TR; Distrib: MICROCHIP
J24 = CON_ETH_POE_ARJM11C7: MagJack 10/100BaseT, PoE+, 1X1, OG/Y, -40 to 85*C, Tab Up, RoHS; Part Number: ARJM11C7-114-BA-EW2; Part Description: 1 Port, Orange Green/Yellow LEDs, RJ45 10/100BaseT, PoE, Ethernet MagJack® Connector Module; Manufacturer: Abracon; PressFit: No; Component Kind: Standard; Component Type: Standard; Pin Count: 18; Family: RJ45; Mounted: Yes; Socket: No; SMD: No; Sense: No; Status: None; Manufacturer Part Number: ARJM11C7-114-BA-EW2; ComponentHeight: 13.61mm; HelpURL: \\cern.ch\dfs\Applications\Altium\Datasheets\BELFUSE_0826-1X1T-GJ-F.pdf; Author: GK; CreateDate: 05.11.2012; LatestRevisionDate: 05.11.2012
L11 = IND0402_MURATA_BLM15HD601SN1: Inductor; Part Description: SMD EMIFIL Suppression Chip Ferrite Bead; Manufacturer: MURATA; Manufacturer Part Number: BLM15HD601SN1D; Power: 300mA; Resistance: 0.85R; Tolerance: ±25%; Part Number: IND0402_MURATA_BLM15HD601SN1; Component Kind: Standard; Component Type: Standard; Pin Count: 2; Value: 600R@100MHz; Status: None; Case: 0402; Mounted: Yes; Socket: No; SMD: Yes; Sense: No; ComponentHeight: 0.55mm; HelpURL: \\cern.ch\dfs\Applications\Altium\Datasheets\IND0402_MURATA_BLM15H.pdf; Author: CERN DEM JLC; CreateDate: 28/02/2012; LatestRevisionDate: 28/02/2012
Q4 = XTAL_25MHZ_ABRACON_ABLS-25.000MHZ-B2F-T: Quartz Crystal; Part Description: Tolerance: ± 20ppm, Stability: ± 50ppm, -20°C to +70°C, 18pF, 40 Ohms ESR, Low Profile Surface Mount Microprocessor Crystal, ABLS Series; PressFit: No; Bonding: No; Part Number: XTAL_25MHZ_ABRACON_ABLS-25.000MHZ-B2F-T; Component Kind: Standard; Component Type: Standard; PackageDescription: SMD Crystal, Body 11.40mm L X 4.70mm W X 4.20mm H, HC/49US (AT49) ALBS Series; Value: 25MHz; Manufacturer: ABRACON; Manufacturer Part Number: ABLS-25.000MHZ-B2F-T; Pin Count: 2; Mounted: Yes; Socket: No; SMD: Yes; Sense: No; ComponentHeight: 4.2mm; HelpURL: \\cern.ch\dfs\Applications\Altium\Datasheets\XTAL_ABRACON_ABLS.pdf; Author: CERN DEM JLC; CreateDate: 03/06/2010; LatestRevisionDate: 15/02/2018
R20 R22 R141 R142 = R0402_49R9_1%_0.0625W_100PPM: Resistor - 1%; Part Description: General Purpose Thick Film Chip Resistor; Manufacturer: GENERIC; Manufacturer1 Part Number: 232270674999L or RC0402FR-0749R9L; TC: ±100ppm/°C; Table: Resistors SMD; Part Number: R0402_49R9_1%_0.0625W_100PPM; Component Kind: Standard; Component Type: Standard; Pin Count: 2; Value: 49R9; Status: Not recommended; Power: 0.0625W; Tolerance: ±1%; Manufacturer Part Number: R0402_49R9_1%_0.0625W_100PPM; Case: 0402; Mounted: Yes; Socket: No; SMD: Yes; Manufacturer1 Example: YAGEO PHYCOMP; Manufacturer1 ComponentHeight: 0.4mm; HelpURL: \\cern.ch\dfs\Applications\Altium\Datasheets\R0402_Phycomp_RC0402.pdf; Author: CERN DEM JLC; CreateDate: 2012-10-24; LatestRevisionDate: 2012-10-24
R21 R140 = R0402_330R_1%_0.0625W_100PPM: Resistor - 1%; Part Description: General Purpose Thick Film Chip Resistor; Manufacturer: GENERIC; Manufacturer1 Part Number: 232270673301L; TC: ±100ppm/°C; PressFit: No; Part Number: R0402_330R_1%_0.0625W_100PPM; Component Kind: Standard; Component Type: Standard; Pin Count: 2; Value: 330; Status: Not Recommended; Power: 0.0625W; Tolerance: ±1%; Manufacturer Part Number: R0402_330R_1%_0.0625W_100PPM; Case: 0402; Mounted: Yes; Sense: No; Socket: No; SMD: Yes; Manufacturer1 Example: YAGEO PHYCOMP; Manufacturer1 ComponentHeight: 0.4mm; HelpURL: \\cern.ch\dfs\Applications\Altium\Datasheets\R0402_Phycomp_RC0402.pdf; Author: CERN DEM JLC; CreateDate: 03.12.2007; LatestRevisionDate: 17.10.2012
R84 R146 R147 R150 = R0402_33R_1%_0.0625W_100PPM: Resistor - 1%; Part Description: General Purpose Thick Film Chip Resistor; Manufacturer: GENERIC; Manufacturer1 Part Number: 232270673309L; TC: ±100ppm/°C; PressFit: No; Part Number: R0402_33R_1%_0.0625W_100PPM; Component Kind: Standard; Component Type: Standard; Pin Count: 2; Value: 33; Status: Not Recommended; Power: 0.0625W; Tolerance: ±1%; Manufacturer Part Number: R0402_33R_1%_0.0625W_100PPM; Case: 0402; Mounted: Yes; Sense: No; Socket: No; SMD: Yes; Manufacturer1 Example: YAGEO PHYCOMP; Manufacturer1 ComponentHeight: 0.4mm; HelpURL: \\cern.ch\dfs\Applications\Altium\Datasheets\R0402_Phycomp_RC0402.pdf; Author: CERN DEM JLC; CreateDate: 03/12/2007; LatestRevisionDate: 17/10/2012
R98 = R0402_1K5_1%_0.0625W_100PPM: Resistor - 1%; Part Description: General Purpose Thick Film Chip Resistor; Manufacturer: GENERIC; Manufacturer1 Part Number: 232270671502L; TC: ±100ppm/°C; PressFit: No; Part Number: R0402_1K5_1%_0.0625W_100PPM; Component Kind: Standard; Component Type: Standard; Pin Count: 2; Value: 1k5; Status: Not Recommended; Power: 0.0625W; Tolerance: ±1%; Manufacturer Part Number: R0402_1K5_1%_0.0625W_100PPM; Case: 0402; Mounted: Yes; Sense: No; Socket: No; SMD: Yes; Manufacturer1 Example: YAGEO PHYCOMP; Manufacturer1 ComponentHeight: 0.4mm; HelpURL: \\cern.ch\dfs\Applications\Altium\Datasheets\R0402_Phycomp_RC0402.pdf; Author: CERN DEM JLC; CreateDate: 03/12/2007; LatestRevisionDate: 17/10/2012
R99 R143-R145 R148 R151 = R0402_10K_1%_0.0625W_100PPM: as R9 on sheet Boost_CNV; Value: 10k; Part Number: R0402_10K_1%_0.0625W_100PPM; Component Kind: Standard; Component Type: Standard; Pin Count: 2; Status: Not Recommended; Power: 0.0625W; Tolerance: ±1%; Manufacturer Part Number: R0402_10K_1%_0.0625W_100PPM; Case: 0402; Mounted: Yes; Sense: No; Socket: No; SMD: Yes; Manufacturer1 Example: YAGEO PHYCOMP; Manufacturer1 ComponentHeight: 0.4mm; HelpURL: \\cern.ch\dfs\Applications\Altium\Datasheets\R0402_Phycomp_RC0402.pdf; Author: CERN DEM JLC; CreateDate: 03/12/2007; LatestRevisionDate: 17/10/2012
R135 = R0603_0R_JUMPER: Resistor; Part Description: 1A (0.05R Max DC Resistance) Zero Ohm Jumper; Manufacturer: GENERIC; Manufacturer1 Part Number: NRC06Z0; PressFit: No; Part Number: R0603_0R_JUMPER; Component Kind: Standard; Component Type: Standard; Pin Count: 2; Value: 0; Status: Preferred; Manufacturer Part Number: R0603_0R_JUMPER; Case: 0603; Mounted: Yes; Sense: No; Socket: No; SMD: Yes; Manufacturer1 Example: NIC COMPONENT; Manufacturer1 ComponentHeight: 0.55mm; HelpURL: \\cern.ch\dfs\Applications\Altium\Datasheets\R0603_NIC_NRC.pdf; Author: CERN DEM JLC; CreateDate: 03.12.2007; LatestRevisionDate: 13.03.2008
R149 = R0402_12K1_1%_0.0625W_100PPM: Resistor - 1%; Part Description: General Purpose Thick Film Chip Resistor; Manufacturer: GENERIC; Manufacturer1 Part Number: 232270671213L or RC0402FR-0712K1L; TC: ±100ppm/°C; PressFit: No; Part Number: R0402_12K1_1%_0.0625W_100PPM; Component Kind: Standard; Component Type: Standard; Pin Count: 2; Value: 12k1; Status: Not Recommended; Power: 0.0625W; Tolerance: ±1%; Manufacturer Part Number: R0402_12K1_1%_0.0625W_100PPM; Case: 0402; Mounted: Yes; Sense: No; Socket: No; SMD: Yes; Manufacturer1 Example: YAGEO PHYCOMP; Manufacturer1 ComponentHeight: 0.4mm; HelpURL: \\cern.ch\dfs\Applications\Altium\Datasheets\R0402_Phycomp_RC0402.pdf; Author: CERN DEM JLC; CreateDate: 24/10/2012; LatestRevisionDate: 24/10/2012

## Sheet USB.SchDoc
size A3
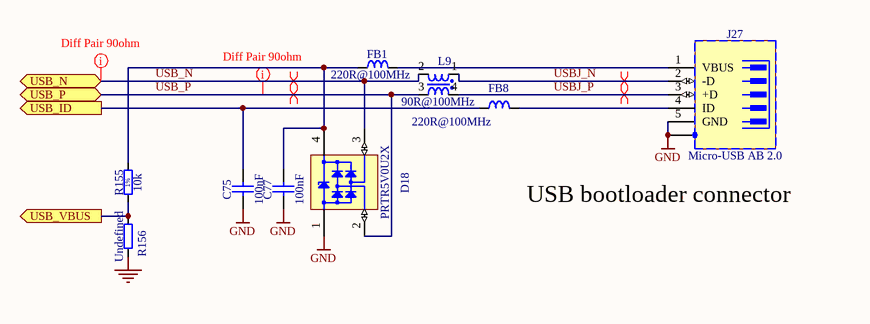
[diagram p4: USB.SchDoc]

### Parts
C75  100nF  [CAPC1005X55N]
C77  100nF  [CAPC1005X55N]
D18  PRTR5V0U2X  [SOT190P230X110-4N]
FB1  220R@100MHz  [INDC2012X105N]
FB8  220R@100MHz  [INDC2012X105N]
J27  Micro-USB AB 2.0  [HIROSE_ZX62RD-AB-5P8(30)]
L9  90R@100MHz  [IND_MURATA_DLW21S]
R155  10k  [RESC1608X55N]
R156  Undefined  [RESC1005X40N]

### Ports
USB_ID (out), USB_N (bidir), USB_P (bidir), USB_VBUS (out)

### Nets
GND: C75.1 C77.1 D18.1(GND) J27.5(GND) J27.6(SH) R156.2
USB_ID: C75.2 FB8.1 ; port USB_ID
USB_N: D18.3(I/O2) L9.2 ; port USB_N
USB_P: D18.2(I/O1) L9.3 ; port USB_P
USB_VBUS: R155.1 R156.1 ; port USB_VBUS
USBJ_N: J27.2(-D) L9.1
USBJ_P: J27.3(+D) L9.4
NetC77_2: C77.2 D18.4(VCC) FB1.1 R155.2
NetFB1_2: FB1.2 J27.1(VBUS)
NetFB8_2: FB8.2 J27.4(ID)

### Layout directives
mark named Diff Pair 90ohm: USB_N, USB_P
differential pair: USB_N, USB_P, USBJ_N, USBJ_P

### Notes on the sheet
- (near J27) USB bootloader connector
- (in symbol R0603_10K_1%_0.1W_100PPM) 1%

### Library data of the parts
C75 C77 = CC0402_100NF_16V_10%_X7R: as C14 on sheet Boost_CNV; Part Number: CC0402_100NF_16V_10%_X7R; Component Kind: Standard; Component Type: Standard; Pin Count: 2; Value: 100nF; Status: Not Recommended; Manufacturer Part Number: CC0402_100NF_16V_10%_X7R; Case: 0402; Mounted: Yes; Socket: No; SMD: Yes; Manufacturer1 Example: MURATA; Manufacturer1 ComponentHeight: 0.55mm; HelpURL: \\cern.ch\dfs\Applications\Altium\Datasheets\CC0402_X7R_MURATA_GRM.pdf; Author: CERN DEM JLC; CreateDate: 05.12.2013; LatestRevisionDate: 03.12.2007; Sense: No
D18 = PRTR5V0U2X: Ultra Low Capacitance Double Rail-to-Rail ESD Protection Diode; Part Description: Ultra Low Capacitance (1pF) Double Rail-to-Rail ESD Protection Diode (8kV); Manufacturer: NXP SEMICONDUCTORS; Voltage: 5.5V; PressFit: No; Bonding: No; Part Number: PRTR5V0U2X; Component Kind: Standard; Component Type: Standard; Device: PRTR5V0U2X; PackageDescription: SOT143B, SOT, 1.90mm Pitch; 4 Pin, 1.30mm W X 2.90mm L X 1.10mm H body, IPC Medium Density; Manufacturer Part Number: PRTR5V0U2X; Pin Count: 4; Case: SOT143B; Mounted: Yes; Socket: No; SMD: Yes; Sense: No; ComponentHeight: 1.1mm; HelpURL: \\cern.ch\dfs\Applications\Altium\Datasheets\PRTR5V0U2X.pdf; Author: CERN DEM JLC; CreateDate: 22.03.2011; LatestRevisionDate: 22.03.2011
FB1 FB8 = IND0805_MURATA_BLM21PG221SN1D: Inductor; Part Description: SMD EMIFIL Suppression Chip Ferrite Bead; Manufacturer: MURATA; Power: 2A; Resistance: 0.05R; Tolerance: ±25%; Table: Inductors SMD; Part Number: IND0805_MURATA_BLM21PG221SN1D; Component Kind: Standard; Component Type: Standard; Pin Count: 2; Value: 220R@100MHz; Status: None; Manufacturer Part Number: BLM21PG221SN1D; Case: 0805; Mounted: Yes; Socket: No; SMD: Yes; ComponentHeight: 1.05mm; HelpURL: \\cern.ch\dfs\Applications\Altium\Datasheets\IND0402_MURATA_BLM21P.pdf; Author: CERN DEM JLC; CreateDate: 2010-01-25; LatestRevisionDate: 2010-01-25
J27 = HIROSE_ZX62RD-AB-5P8(30): 5 Pin + 1 Shield USB Receptacle; Part Description: Micro-USB 2.0 Right Angle, SMD Type AB - Reverse (Top mount), Shell Through Hole; Manufacturer: HIROSE (HRS); PressFit: No; Part Number: HIROSE_ZX62RD-AB-5P8(30); Component Kind: Standard; Component Type: Standard; Pin Count: 7; Family: Micro-USB AB 2.0; Mounted: Yes; Socket: No; SMD: Yes; Sense: No; Status: None; Manufacturer Part Number: ZX62RD-AB-5P8(30); ComponentHeight: 2.35mm; HelpURL: \\cern.ch\dfs\Applications\Altium\Datasheets\HIROSE_ZX62RD-AB-5P8(30).pdf; ComponentLink1URL: \\cern.ch\dfs\Applications\Altium\Datasheets\HIROSE_ZX62RD-AB-5P8(30)_Package-Drawing.pdf; ComponentLink1Description: Package-Drawing; Author: CERN DEM JMW; CreateDate: 22.06.2017; LatestRevisionDate: 22.06.2017
L9 = IND_MURATA_DLW21SN900SQ2L: Inductor Common Mode; Part Description: Wire Wound Common Mode Choke Coil (DLW21S Series); Manufacturer: MURATA; Power: 330mA; Resistance: 0.35R; Tolerance: ±25%; Part Number: IND_MURATA_DLW21SN900SQ2L; Component Kind: Standard; Component Type: Standard; Pin Count: 4; Value: 90R@100MHz; Status: None; Manufacturer Part Number: DLW21SN900SQ2L; Case: 0805; Mounted: Yes; Socket: No; SMD: Yes; Sense: No; ComponentHeight: 1.4mm; HelpURL: \\cern.ch\dfs\Applications\Altium\Datasheets\IND_MURATA_DLW21S.pdf; Author: CERN DEM JLC; CreateDate: 01.07.2014; LatestRevisionDate: 01.07.2014
R155 = R0603_10K_1%_0.1W_100PPM: Resistor - 1%; Part Description: General Purpose Thick Film Chip Resistor; Manufacturer: GENERIC; Manufacturer1 Part Number: NRC06F1002TRF; Power: 0.1W; TC: ±100ppm/°C; PressFit: No; Part Number: R0603_10K_1%_0.1W_100PPM; Component Kind: Standard; Component Type: Standard; Pin Count: 2; Value: 10k; Status: Preferred; Tolerance: ±1%; Manufacturer Part Number: R0603_10K_1%_0.1W_100PPM; Case: 0603; Mounted: Yes; Sense: No; Socket: No; SMD: Yes; Manufacturer1 Example: NIC COMPONENT; Manufacturer1 ComponentHeight: 0.55mm; HelpURL: \\cern.ch\dfs\Applications\Altium\Datasheets\R0603_NIC_NRC.pdf; Author: CERN DEM JLC; CreateDate: 03/12/2007; LatestRevisionDate: 13/03/2008
R156 = R0402_NO-VALUE: Resistor; Part Description: Reserved Footprint For a 0402 (1005) Chip Resistor; Mounted: No; PressFit: No; Part Number: R0402_NO-VALUE; Component Kind: Standard; Component Type: Standard; Pin Count: 2; Value: Undefined; Status: None; Manufacturer: Undefined; Manufacturer Part Number: R0402_NO-VALUE; Case: 0402; Sense: No; Socket: No; SMD: Yes; Manufacturer1 Example: Undefined; Manufacturer1 Part Number: Undefined; Manufacturer1 ComponentHeight: Undefined; HelpURL: Undefined; Author: CERN DEM JLC; CreateDate: 03/12/2007; LatestRevisionDate: 13/03/2008